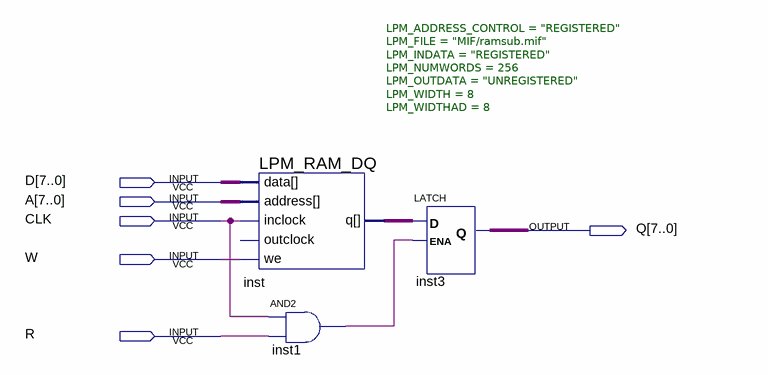
[diagram p0: schematic sheet]
// Quartus schematic memsim.bdf as structural Verilog: 3 symbols, 6 pins
module memsim (
  input  [7:0] D,
  input  [7:0] A,
  input  CLK,
  input  W,
  input  R,
  output [7:0] Q
);

  wire inst1_out;
  wire [7:0] inst_q;

  LPM_RAM_DQ #(.LPM_ADDRESS_CONTROL("REGISTERED"), .LPM_FILE("MIF/ramsub.mif"), .LPM_INDATA("REGISTERED"), .LPM_NUMWORDS(256), .LPM_OUTDATA("UNREGISTERED"), .LPM_WIDTH(8), .LPM_WIDTHAD(8)) inst (
    .inclock(CLK), .data(D), .address(A), .we(W), .q(inst_q));  // open: outclock
  and inst1 (inst1_out, CLK, R);
  LATCH inst3[7:0] (.D(inst_q), .ENA(inst1_out), .Q(Q));
endmodule
